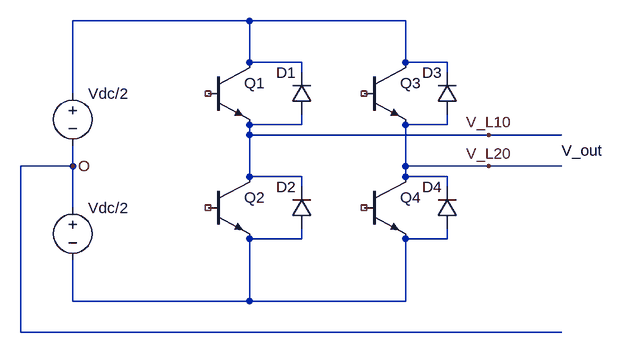
[diagram p0: schematic DC-to-AC-full-bridge_draw.asc]
DC-to-AC-full-bridge_draw.asc, the LTspice schematic file:
Version 4
SHEET 1 1936 680
WIRE 288 16 16 16
WIRE 528 16 288 16
WIRE 288 80 288 16
WIRE 368 80 288 80
WIRE 528 80 528 16
WIRE 592 80 528 80
WIRE 368 96 368 80
WIRE 592 96 592 80
WIRE 16 128 16 16
WIRE 368 176 368 160
WIRE 368 176 288 176
WIRE 592 176 592 160
WIRE 592 176 528 176
WIRE 288 192 288 176
WIRE 656 192 288 192
WIRE 768 192 656 192
WIRE 16 240 16 208
WIRE 16 240 -64 240
WIRE 528 240 528 176
WIRE 656 240 528 240
WIRE 768 240 656 240
WIRE 288 256 288 192
WIRE 368 256 288 256
WIRE 528 256 528 240
WIRE 592 256 528 256
WIRE 368 272 368 256
WIRE 592 272 592 256
WIRE 16 304 16 240
WIRE 368 352 368 336
WIRE 368 352 288 352
WIRE 592 352 592 336
WIRE 592 352 528 352
WIRE 16 448 16 384
WIRE 288 448 288 352
WIRE 288 448 16 448
WIRE 528 448 528 352
WIRE 528 448 288 448
WIRE -64 496 -64 240
WIRE 768 496 -64 496
FLAG 16 240 O
FLAG 656 192 V_L10
FLAG 656 240 V_L20
SYMBOL voltage 16 112 R0
WINDOW 123 0 0 Left 0
WINDOW 39 0 0 Left 0
SYMATTR InstName Vdc/2
SYMATTR Value ""
SYMBOL voltage 16 288 R0
WINDOW 123 0 0 Left 0
WINDOW 39 0 0 Left 0
SYMATTR InstName Vdc/2
SYMATTR Value ""
SYMBOL npn 224 80 R0
SYMATTR InstName Q1
SYMATTR Value ""
SYMBOL npn 224 256 R0
SYMATTR InstName Q2
SYMATTR Value ""
SYMBOL npn 464 80 R0
SYMATTR InstName Q3
SYMATTR Value ""
SYMBOL npn 464 256 R0
SYMATTR InstName Q4
SYMATTR Value ""
SYMBOL diode 384 160 R180
WINDOW 0 24 64 Left 2
WINDOW 3 24 0 Left 2
SYMATTR InstName D1
SYMATTR Value ""
SYMBOL diode 384 336 R180
WINDOW 0 24 64 Left 2
WINDOW 3 24 0 Left 2
SYMATTR InstName D2
SYMATTR Value ""
SYMBOL diode 608 336 R180
WINDOW 0 24 64 Left 2
WINDOW 3 24 0 Left 2
SYMATTR InstName D4
SYMATTR Value ""
SYMBOL diode 608 160 R180
WINDOW 0 24 64 Left 2
WINDOW 3 24 0 Left 2
SYMATTR InstName D3
SYMATTR Value ""
TEXT 768 216 Left 2 !V_out

The netlist it stands for:
* DC-to-AC-full-bridge_draw.asc
Vdc/2 N001 O
Vdc/2 O N002
Q1 N001 NC_01 V_L10 0
Q2 V_L10 NC_02 N002 0
Q3 N001 NC_03 V_L20 0
Q4 V_L20 NC_04 N002 0
D1 V_L10 N001
D2 N002 V_L10
D4 N002 V_L20
D3 V_L20 N001
.model D D
.lib standard.dio
.model NPN NPN
.model PNP PNP
.lib standard.bjt
V_out
.backanno
.end